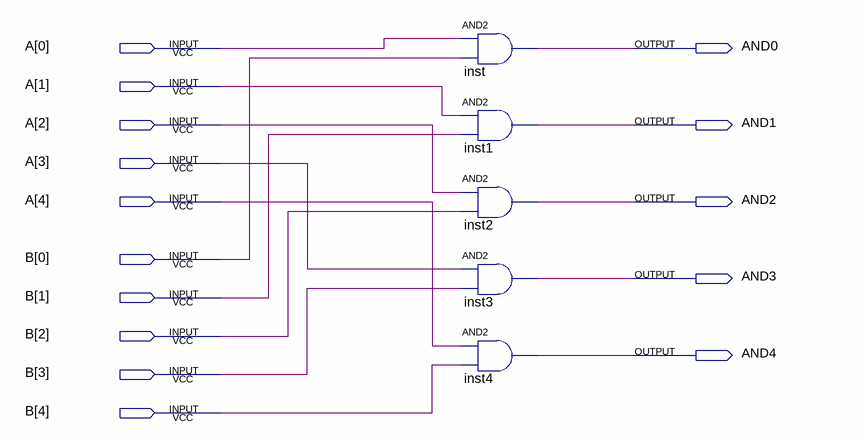
[diagram p0: schematic sheet]
// Quartus schematic AANDB.bdf as structural Verilog: 5 symbols, 15 pins
module AANDB (
  input  [4:0] A,
  input  [4:0] B,
  output AND0,
  output AND1,
  output AND2,
  output AND3,
  output AND4
);

  and inst (AND0, A[0], B[0]);
  and inst1 (AND1, A[1], B[1]);
  and inst2 (AND2, A[2], B[2]);
  and inst3 (AND3, A[3], B[3]);
  and inst4 (AND4, A[4], B[4]);
endmodule
